# Altium project roach2_project rev2.PrjPCB (part 10 of 13)

## Sheet mgt_breakout.SchDoc: MGT Mezzanine Card Interfaces
size A3; Date: DO NOT USE, RATHER USE PROJ OPTIONS; DrawnBy: DO NOT USE, RATHER USE PROJ OPTIONS; Engineer: DO NOT USE, RATHER USE PROJ OPTIONS; Organization: DO NOT USE, RATHER USE PROJ OPTIONS; DocumentNumber: DO NOT USE, RATHER USE PROJ OPTIONS; Revision: DO NOT USE, RATHER USE PROJ OPTIONS; SheetNumber: 24; SheetTotal: 29; SCH_Sheet_Filename: mgt_breakout.SchDoc; CurrentTime: DO NOT USE, RATHER USE PROJ OPTIONS; Time: DO NOT USE, RATHER USE PROJ OPTIONS; DocumentFullPathAndName: DO NOT USE, RATHER USE PROJ OPTIONS; DocumentName: DO NOT USE, RATHER USE PROJ OPTIONS; ModifiedDate: DO NOT USE, RATHER USE PROJ OPTIONS; ImagePath: DO NOT USE, RATHER USE PROJ OPTIONS
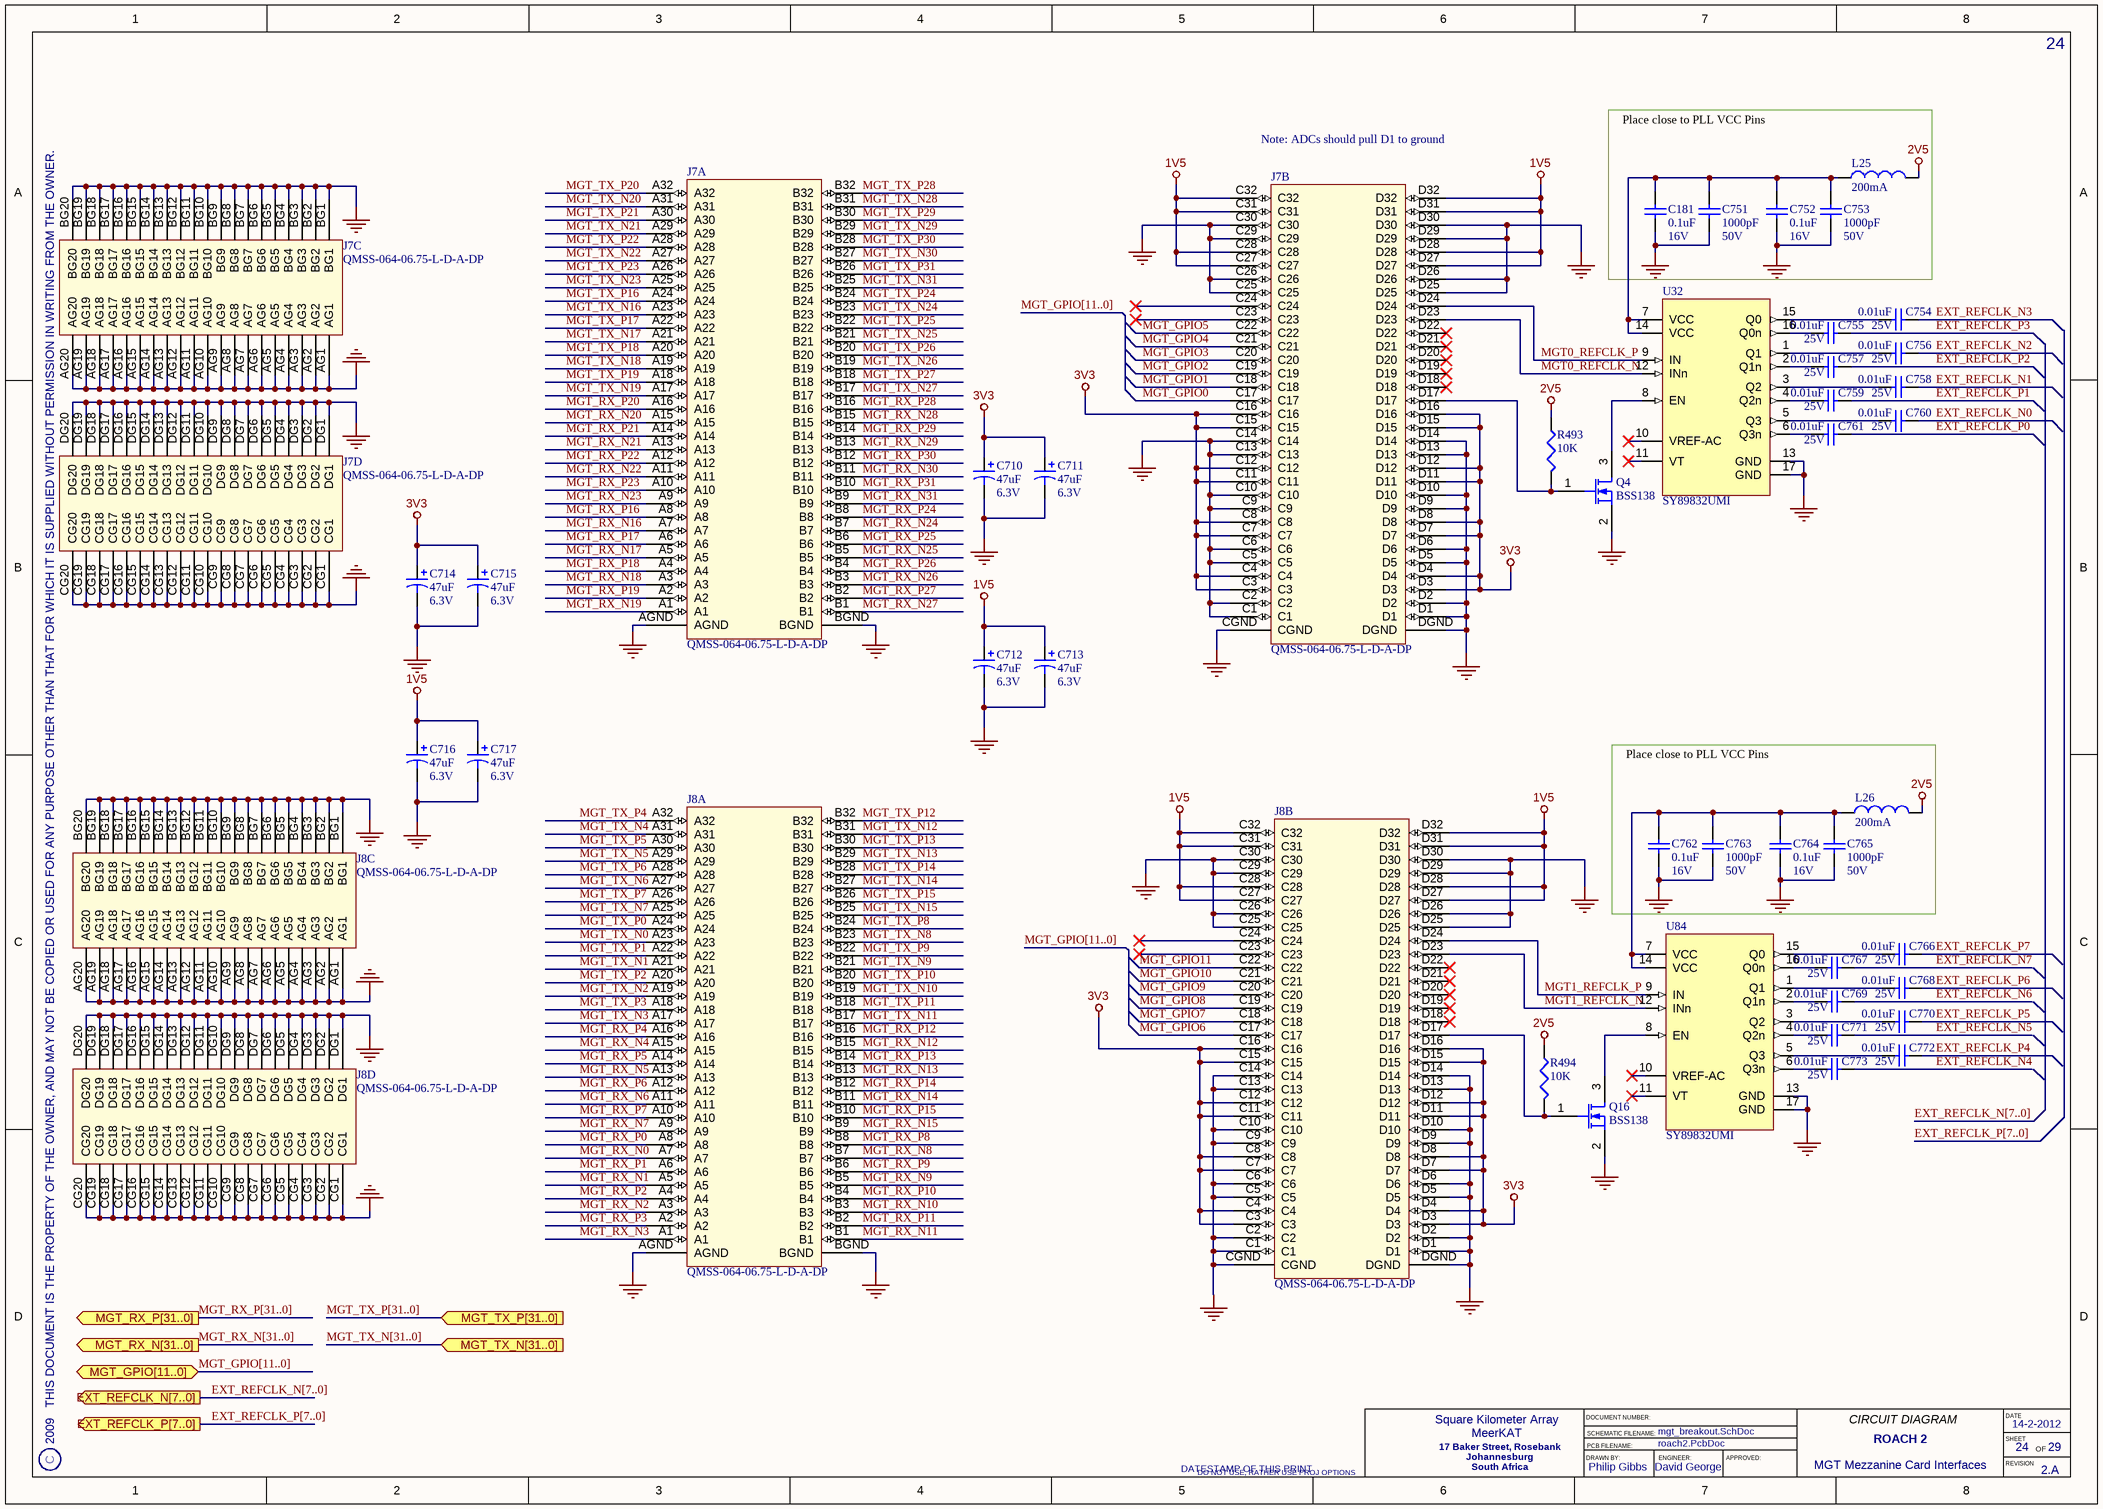
[diagram p20: mgt_breakout.SchDoc]

### Parts
C181  Rating: 16V  [CAPC1005X60L]  (hidden comment: 0.1uF)
C710  Rating: 6.3V  [CAPMP3528X120L]  (hidden comment: 47uF)
C711  Rating: 6.3V  [CAPMP3528X120L]  (hidden comment: 47uF)
C712  Rating: 6.3V  [CAPMP3528X120L]  (hidden comment: 47uF)
C713  Rating: 6.3V  [CAPMP3528X120L]  (hidden comment: 47uF)
C714  Rating: 6.3V  [CAPMP3528X120L]  (hidden comment: 47uF)
C715  Rating: 6.3V  [CAPMP3528X120L]  (hidden comment: 47uF)
C716  Rating: 6.3V  [CAPMP3528X120L]  (hidden comment: 47uF)
C717  Rating: 6.3V  [CAPMP3528X120L]  (hidden comment: 47uF)
C751  Rating: 50V  [CAPC1005X55L]  (hidden comment: 1000pF)
C752  Rating: 16V  [CAPC1005X60L]  (hidden comment: 0.1uF)
C753  Rating: 50V  [CAPC1005X55L]  (hidden comment: 1000pF)
C754  Rating: 25V  [CAPC1005X55L]  (hidden comment: 0.01uF)
C755  Rating: 25V  [CAPC1005X55L]  (hidden comment: 0.01uF)
C756  Rating: 25V  [CAPC1005X55L]  (hidden comment: 0.01uF)
C757  Rating: 25V  [CAPC1005X55L]  (hidden comment: 0.01uF)
C758  Rating: 25V  [CAPC1005X55L]  (hidden comment: 0.01uF)
C759  Rating: 25V  [CAPC1005X55L]  (hidden comment: 0.01uF)
C760  Rating: 25V  [CAPC1005X55L]  (hidden comment: 0.01uF)
C761  Rating: 25V  [CAPC1005X55L]  (hidden comment: 0.01uF)
C762  Rating: 16V  [CAPC1005X60L]  (hidden comment: 0.1uF)
C763  Rating: 50V  [CAPC1005X55L]  (hidden comment: 1000pF)
C764  Rating: 16V  [CAPC1005X60L]  (hidden comment: 0.1uF)
C765  Rating: 50V  [CAPC1005X55L]  (hidden comment: 1000pF)
C766  Rating: 25V  [CAPC1005X55L]  (hidden comment: 0.01uF)
C767  Rating: 25V  [CAPC1005X55L]  (hidden comment: 0.01uF)
C768  Rating: 25V  [CAPC1005X55L]  (hidden comment: 0.01uF)
C769  Rating: 25V  [CAPC1005X55L]  (hidden comment: 0.01uF)
C770  Rating: 25V  [CAPC1005X55L]  (hidden comment: 0.01uF)
C771  Rating: 25V  [CAPC1005X55L]  (hidden comment: 0.01uF)
C772  Rating: 25V  [CAPC1005X55L]  (hidden comment: 0.01uF)
C773  Rating: 25V  [CAPC1005X55L]  (hidden comment: 0.01uF)
J7  PartNum: QMSS-064-06.75-L-D-A-DP  [SAMTEC_QMSS-064-06_75-L-D-A-DP]  (hidden comment: QMSS-064-06_75-L-D-A-DP)  (parts A,B,C,D of 4)
J8  PartNum: QMSS-064-06.75-L-D-A-DP  [SAMTEC_QMSS-064-06_75-L-D-A-DP]  (hidden comment: QMSS-064-06_75-L-D-A-DP)  (parts A,B,C,D of 4)
L25  Rating: 200mA  [INDC2012X130L]  (hidden comment: 600R)
L26  Rating: 200mA  [INDC2012X130L]  (hidden comment: 600R)
Q4  BSS138  [SOT95P245X110-3N]
Q16  BSS138  [SOT95P245X110-3N]
R493  10K  [RESC1005X40L]
R494  10K  [RESC1005X40L]
U32  SY89832UMI  [MLF-16]
U84  SY89832UMI  [MLF-16]

### Ports
EXT_REFCLK_N[7..0] (out), EXT_REFCLK_P[7..0] (out), MGT_GPIO[11..0] (bidir), MGT_RX_N[31..0] (out), MGT_RX_P[31..0] (out), MGT_TX_N[31..0] (in), MGT_TX_P[31..0] (in)

### Nets
1V5: C712.1 C713.1 C716.1 C717.1 J7.C27 J7.C28 J7.C31 J7.C32 J7.D27 J7.D28 J7.D31 J7.D32 J8.C27 J8.C28 J8.C31 J8.C32 J8.D27 J8.D28 J8.D31 J8.D32
2V5: L25.2 L26.2 R493.1 R494.1
3V3: C710.1 C711.1 C714.1 C715.1 J7.C3 J7.C4 J7.C7 J7.C8 J7.C11 J7.C12 J7.C15 J7.C16 J7.D3 J7.D4 J7.D7 J7.D8 J7.D11 J7.D12 J7.D15 J7.D16 J8.C3 J8.C4 J8.C7 J8.C8 J8.C11 J8.C12 J8.C15 J8.C16 J8.D3 J8.D4 J8.D7 J8.D8 J8.D11 J8.D12 J8.D15 J8.D16
GND: C181.1 C710.2 C711.2 C712.2 C713.2 C714.2 C715.2 C716.2 C717.2 C751.1 C752.1 C753.1 C762.1 C763.1 C764.1 C765.1 J7.AG1 J7.AG2 J7.AG3 J7.AG4 J7.AG5 J7.AG6 J7.AG7 J7.AG8 J7.AG9 J7.AG10 J7.AG11 J7.AG12 J7.AG13 J7.AG14 J7.AG15 J7.AG16 J7.AG17 J7.AG18 J7.AG19 J7.AG20 J7.AGND J7.BG1 J7.BG2 J7.BG3 J7.BG4 J7.BG5 J7.BG6 J7.BG7 J7.BG8 J7.BG9 J7.BG10 J7.BG11 J7.BG12 J7.BG13 J7.BG14 J7.BG15 J7.BG16 J7.BG17 J7.BG18 J7.BG19 J7.BG20 J7.BGND J7.C1 J7.C2 J7.C5 J7.C6 J7.C9 J7.C10 J7.C13 J7.C14 J7.C25 J7.C26 J7.C29 J7.C30 J7.CG1 J7.CG2 J7.CG3 J7.CG4 J7.CG5 J7.CG6 J7.CG7 J7.CG8 J7.CG9 J7.CG10 J7.CG11 J7.CG12 J7.CG13 J7.CG14 J7.CG15 J7.CG16 J7.CG17 J7.CG18 J7.CG19 J7.CG20 J7.CGND J7.D1 J7.D2 J7.D5 J7.D6 J7.D9 J7.D10 J7.D13 J7.D14 J7.D25 J7.D26 J7.D29 J7.D30 J7.DG1 J7.DG2 J7.DG3 J7.DG4 J7.DG5 J7.DG6 J7.DG7 J7.DG8 J7.DG9 J7.DG10 J7.DG11 J7.DG12 J7.DG13 J7.DG14 J7.DG15 J7.DG16 J7.DG17 J7.DG18 J7.DG19 J7.DG20 J7.DGND J8.AG1 J8.AG2 J8.AG3 J8.AG4 J8.AG5 J8.AG6 J8.AG7 J8.AG8 J8.AG9 J8.AG10 J8.AG11 J8.AG12 J8.AG13 J8.AG14 J8.AG15 J8.AG16 J8.AG17 J8.AG18 J8.AG19 J8.AG20 J8.AGND J8.BG1 J8.BG2 J8.BG3 J8.BG4 J8.BG5 J8.BG6 J8.BG7 J8.BG8 J8.BG9 J8.BG10 J8.BG11 J8.BG12 J8.BG13 J8.BG14 J8.BG15 J8.BG16 J8.BG17 J8.BG18 J8.BG19 J8.BG20 J8.BGND J8.C1 J8.C2 J8.C5 J8.C6 J8.C9 J8.C10 J8.C13 J8.C14 J8.C25 J8.C26 J8.C29 J8.C30 J8.CG1 J8.CG2 J8.CG3 J8.CG4 J8.CG5 J8.CG6 J8.CG7 J8.CG8 J8.CG9 J8.CG10 J8.CG11 J8.CG12 J8.CG13 J8.CG14 J8.CG15 J8.CG16 J8.CG17 J8.CG18 J8.CG19 J8.CG20 J8.CGND J8.D1 J8.D2 J8.D5 J8.D6 J8.D9 J8.D10 J8.D13 J8.D14 J8.D25 J8.D26 J8.D29 J8.D30 J8.DG1 J8.DG2 J8.DG3 J8.DG4 J8.DG5 J8.DG6 J8.DG7 J8.DG8 J8.DG9 J8.DG10 J8.DG11 J8.DG12 J8.DG13 J8.DG14 J8.DG15 J8.DG16 J8.DG17 J8.DG18 J8.DG19 J8.DG20 J8.DGND Q4.2(S) Q16.2(S) U32.13(GND) U32.17(GND) U84.13(GND) U84.17(GND)
EXT_REFCLK_N0: C760.2
EXT_REFCLK_N1: C758.2
EXT_REFCLK_N2: C756.2
EXT_REFCLK_N3: C754.2
EXT_REFCLK_N4: C773.2
EXT_REFCLK_N5: C771.2
EXT_REFCLK_N6: C769.2
EXT_REFCLK_N7: C767.2
EXT_REFCLK_P0: C761.2
EXT_REFCLK_P1: C759.2
EXT_REFCLK_P2: C757.2
EXT_REFCLK_P3: C755.2
EXT_REFCLK_P4: C772.2
EXT_REFCLK_P5: C770.2
EXT_REFCLK_P6: C768.2
EXT_REFCLK_P7: C766.2
MGT0_REFCLK_N: J7.D23 U32.12(INn)
MGT0_REFCLK_P: J7.D24 U32.9(IN)
MGT1_REFCLK_N: J8.D23 U84.12(INn)
MGT1_REFCLK_P: J8.D24 U84.9(IN)
MGT_GPIO0: J7.C17
MGT_GPIO1: J7.C18
MGT_GPIO2: J7.C19
MGT_GPIO3: J7.C20
MGT_GPIO4: J7.C21
MGT_GPIO5: J7.C22
MGT_GPIO6: J8.C17
MGT_GPIO7: J8.C18
MGT_GPIO8: J8.C19
MGT_GPIO9: J8.C20
MGT_GPIO10: J8.C21
MGT_GPIO11: J8.C22
MGT_RX_N0: J8.A7
MGT_RX_N1: J8.A5
MGT_RX_N2: J8.A3
MGT_RX_N3: J8.A1
MGT_RX_N4: J8.A15
MGT_RX_N5: J8.A13
MGT_RX_N6: J8.A11
MGT_RX_N7: J8.A9
MGT_RX_N8: J8.B7
MGT_RX_N9: J8.B5
MGT_RX_N10: J8.B3
MGT_RX_N11: J8.B1
MGT_RX_N12: J8.B15
MGT_RX_N13: J8.B13
MGT_RX_N14: J8.B11
MGT_RX_N15: J8.B9
MGT_RX_N16: J7.A7
MGT_RX_N17: J7.A5
MGT_RX_N18: J7.A3
MGT_RX_N19: J7.A1
MGT_RX_N20: J7.A15
MGT_RX_N21: J7.A13
MGT_RX_N22: J7.A11
MGT_RX_N23: J7.A9
MGT_RX_N24: J7.B7
MGT_RX_N25: J7.B5
MGT_RX_N26: J7.B3
MGT_RX_N27: J7.B1
MGT_RX_N28: J7.B15
MGT_RX_N29: J7.B13
MGT_RX_N30: J7.B11
MGT_RX_N31: J7.B9
MGT_RX_P0: J8.A8
MGT_RX_P1: J8.A6
MGT_RX_P2: J8.A4
MGT_RX_P3: J8.A2
MGT_RX_P4: J8.A16
MGT_RX_P5: J8.A14
MGT_RX_P6: J8.A12
MGT_RX_P7: J8.A10
MGT_RX_P8: J8.B8
MGT_RX_P9: J8.B6
MGT_RX_P10: J8.B4
MGT_RX_P11: J8.B2
MGT_RX_P12: J8.B16
MGT_RX_P13: J8.B14
MGT_RX_P14: J8.B12
MGT_RX_P15: J8.B10
MGT_RX_P16: J7.A8
MGT_RX_P17: J7.A6
MGT_RX_P18: J7.A4
MGT_RX_P19: J7.A2
MGT_RX_P20: J7.A16
MGT_RX_P21: J7.A14
MGT_RX_P22: J7.A12
MGT_RX_P23: J7.A10
MGT_RX_P24: J7.B8
MGT_RX_P25: J7.B6
MGT_RX_P26: J7.B4
MGT_RX_P27: J7.B2
MGT_RX_P28: J7.B16
MGT_RX_P29: J7.B14
MGT_RX_P30: J7.B12
MGT_RX_P31: J7.B10
MGT_TX_N0: J8.A23
MGT_TX_N1: J8.A21
MGT_TX_N2: J8.A19
MGT_TX_N3: J8.A17
MGT_TX_N4: J8.A31
MGT_TX_N5: J8.A29
MGT_TX_N6: J8.A27
MGT_TX_N7: J8.A25
MGT_TX_N8: J8.B23
MGT_TX_N9: J8.B21
MGT_TX_N10: J8.B19
MGT_TX_N11: J8.B17
MGT_TX_N12: J8.B31
MGT_TX_N13: J8.B29
MGT_TX_N14: J8.B27
MGT_TX_N15: J8.B25
MGT_TX_N16: J7.A23
MGT_TX_N17: J7.A21
MGT_TX_N18: J7.A19
MGT_TX_N19: J7.A17
MGT_TX_N20: J7.A31
MGT_TX_N21: J7.A29
MGT_TX_N22: J7.A27
MGT_TX_N23: J7.A25
MGT_TX_N24: J7.B23
MGT_TX_N25: J7.B21
MGT_TX_N26: J7.B19
MGT_TX_N27: J7.B17
MGT_TX_N28: J7.B31
MGT_TX_N29: J7.B29
MGT_TX_N30: J7.B27
MGT_TX_N31: J7.B25
MGT_TX_P0: J8.A24
MGT_TX_P1: J8.A22
MGT_TX_P2: J8.A20
MGT_TX_P3: J8.A18
MGT_TX_P4: J8.A32
MGT_TX_P5: J8.A30
MGT_TX_P6: J8.A28
MGT_TX_P7: J8.A26
MGT_TX_P8: J8.B24
MGT_TX_P9: J8.B22
MGT_TX_P10: J8.B20
MGT_TX_P11: J8.B18
MGT_TX_P12: J8.B32
MGT_TX_P13: J8.B30
MGT_TX_P14: J8.B28
MGT_TX_P15: J8.B26
MGT_TX_P16: J7.A24
MGT_TX_P17: J7.A22
MGT_TX_P18: J7.A20
MGT_TX_P19: J7.A18
MGT_TX_P20: J7.A32
MGT_TX_P21: J7.A30
MGT_TX_P22: J7.A28
MGT_TX_P23: J7.A26
MGT_TX_P24: J7.B24
MGT_TX_P25: J7.B22
MGT_TX_P26: J7.B20
MGT_TX_P27: J7.B18
MGT_TX_P28: J7.B32
MGT_TX_P29: J7.B30
MGT_TX_P30: J7.B28
MGT_TX_P31: J7.B26
NetC181_2: C181.2 C751.2 C752.2 C753.2 L25.1 U32.7(VCC) U32.14(VCC)
NetC754_1: C754.1 U32.15(Q0)
NetC755_1: C755.1 U32.16(Q0n)
NetC756_1: C756.1 U32.1(Q1)
NetC757_1: C757.1 U32.2(Q1n)
NetC758_1: C758.1 U32.3(Q2)
NetC759_1: C759.1 U32.4(Q2n)
NetC760_1: C760.1 U32.5(Q3)
NetC761_1: C761.1 U32.6(Q3n)
NetC762_2: C762.2 C763.2 C764.2 C765.2 L26.1 U84.7(VCC) U84.14(VCC)
NetC766_1: C766.1 U84.15(Q0)
NetC767_1: C767.1 U84.16(Q0n)
NetC768_1: C768.1 U84.1(Q1)
NetC769_1: C769.1 U84.2(Q1n)
NetC770_1: C770.1 U84.3(Q2)
NetC771_1: C771.1 U84.4(Q2n)
NetC772_1: C772.1 U84.5(Q3)
NetC773_1: C773.1 U84.6(Q3n)
NetJ7_D17: J7.D17 Q4.1(G) R493.2
NetJ8_D17: J8.D17 Q16.1(G) R494.2
NetQ4_3: Q4.3(D) U32.8(EN)
NetQ16_3: Q16.3(D) U84.8(EN)

Not connected (* = marked no-connect by the designer): J7 C23* C24* D18* D19* D20* D21* D22*; J8 C23* C24* D18* D19* D20* D21* D22*; U32 10(VREF-AC)* 11(VT)*; U84 10(VREF-AC)* 11(VT)*

### Buses and harness runs
bus EXT_REFCLK_N[7..0]
bus EXT_REFCLK_N[7..0] = port EXT_REFCLK_N[7..0]
bus EXT_REFCLK_P[7..0]
bus EXT_REFCLK_P[7..0] = port EXT_REFCLK_P[7..0]
bus MGT_GPIO[11..0]
bus MGT_GPIO[11..0] = port MGT_GPIO[11..0]
bus MGT_RX_N[31..0] = port MGT_RX_N[31..0]
bus MGT_RX_P[31..0] = port MGT_RX_P[31..0]
bus MGT_TX_N[31..0] = port MGT_TX_N[31..0]
bus MGT_TX_P[31..0] = port MGT_TX_P[31..0]

### Notes on the sheet
- (near J7) Note: ADCs should pull D1 to ground
- Place close to PLL VCC Pins
- 2009   THIS DOCUMENT IS THE PROPERTY OF THE OWNER, AND MAY NOT BE COPIED OR USED FOR ANY PURPOSE OTHER THAN THAT FOR WHICH IT IS SUPPLIED WITHOUT PERMISSION IN WRITING FROM THE OWNER.
- C
- DATESTAMP OF THIS PRINT
- DRAWN BY:
- DOCUMENT NUMBER:
- SCHEMATIC FILENAME:
- PCB FILENAME:
- ENGINEER:
- APPROVED:
- CIRCUIT DIAGRAM
- DATE
- SHEET
- REVISION
- OF

### Library data of the parts
C181 C752 C762 C764 = CAP-CER-1: as C58 on sheet ppc_power; POD number: CAP-CER-1; Value: 0.1uF; RoHS: Y; Sort Value: 0.1; Category: Capacitors; Subcategory: Ceramic
C710-C717 = CAP-TAN-1: as C394-C396 on sheet v6_io_27_28_32_33; POD number: CAP-TAN-1; Value: 47uF; RoHS: Y; Sort Value: 47; Category: Capacitors; Subcategory: Tantalum
C751 C753 C763 C765 = CAP-CER-4: as C60 on sheet ppc_power; POD number: CAP-CER-4; Value: 1000pF; RoHS: Y; Sort Value: 0.0001; Category: Capacitors; Subcategory: Ceramic
C754-C761 C766-C773 = CAP-CER-6: 0.01uF, Ceramic Capacitor; Manufacturer: MURATA; PartNum: GRM155R71E103KA01D; Tolerance: 10%; Dielectric: X7R; POD number: CAP-CER-6; Value: 0.01uF; RoHS: Y; Sort Value: 0.01; Category: Capacitors; Subcategory: Ceramic
J7 J8 = CONN-PCB-23: Shielded, 64-Differential Pair, Rugged High-Speed Terminal Strip, 0.635mm Pitch,; POD number: CONN-PCB-23
L25 L26 = IND-FB-0: as L9 on sheet ppc_power; POD number: IND-FB-0; RoHS: Y; Value: 600R; Sort Value: 600; Category: Inductors; Subcategory: FerriteBead
Q4 Q16 = TRANS-NFET-0: N-Channel Logic Level Enhancement Mode Field Effect Transistor; Manufacturer: Fairchild Semiconductor; Rating: 0.22A; POD number: TRANS-NFET-0; PartNum: BSS138; RoHS: Y; Category: TRANS; Subcategory: NFET
R493 R494 = RES-TF-5: 10K, 1.1mm x 0.5mm, Thick Film Resistor; Manufacturer: ROYALOHM; PartNum: 0402WGJ0103T1E; Tolerance: 5%; Rating: 0.0625W; POD number: RES-TF-5; Value: 10K; Sort Value: 10000; Category: Resistors; Subcategory: ThickFilm; HelpURL: *.pdf
U32 U84 = IC-LOG-14: 2.5 C Ultra-precision 1:4 LVDS Fanout Buffer/Translator with Interal Termination; Manufacturer: Micrel; POD number: IC-LOG-14; PartNum: SY89832UMI; RoHS: Y; Category: IC; Subcategory: Logic